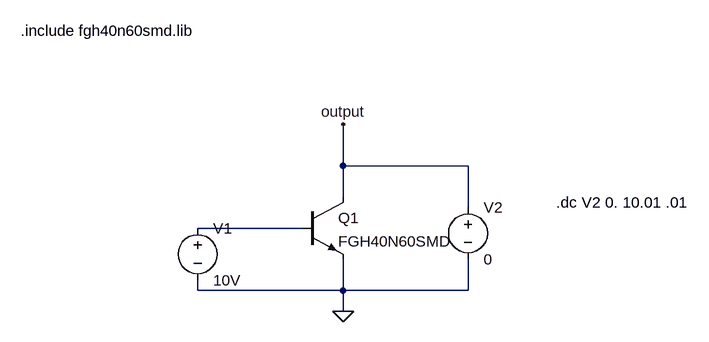
[diagram p0: schematic schem.asc]
schem.asc, the LTspice schematic file:
Version 4.1
SHEET 1 900 680
WIRE 320 208 320 144
WIRE 512 208 320 208
WIRE 320 256 320 208
WIRE 512 272 512 208
WIRE 256 304 96 304
WIRE 96 400 96 384
WIRE 320 400 320 352
WIRE 320 400 96 400
WIRE 512 400 512 352
WIRE 512 400 320 400
WIRE 320 432 320 400
FLAG 320 432 0
FLAG 320 144 output
SYMBOL npn 256 256 R0
SYMATTR InstName Q1
SYMATTR Value FGH40N60SMD
SYMATTR Prefix X
SYMATTR SpiceModel FGH40N60SMD
SYMBOL voltage 96 288 R0
WINDOW 123 0 0 Left 0
WINDOW 39 0 0 Left 0
SYMATTR InstName V1
SYMATTR Value 10V
SYMBOL voltage 512 256 R0
WINDOW 123 0 0 Left 0
WINDOW 39 0 0 Left 0
SYMATTR InstName V2
SYMATTR Value 0
TEXT -176 0 Left 2 !.include fgh40n60smd.lib
TEXT 648 264 Left 2 !.dc V2 0. 10.01 .01

The netlist it stands for:
* schem.asc
X§Q1 output N001 0 FGH40N60SMD FGH40N60SMD  ; pins C B E
V1 N001 0 10V
V2 output 0 0
.include fgh40n60smd.lib
.dc V2 0. 10.01 .01
.backanno
.end